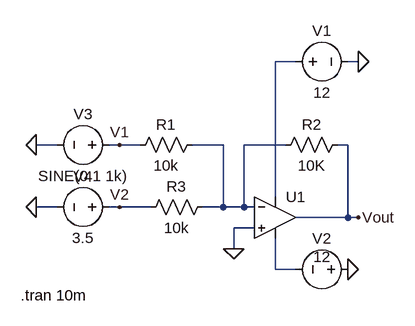
[diagram p0: schematic adder.asc]
adder.asc, the LTspice schematic file:
Version 4
SHEET 1 880 680
WIRE 240 -80 208 -80
WIRE 336 -80 320 -80
WIRE -128 48 -160 48
WIRE -32 48 -48 48
WIRE 0 48 -32 48
WIRE 128 48 80 48
WIRE 224 48 160 48
WIRE 320 48 304 48
WIRE 208 128 208 -80
WIRE -128 144 -160 144
WIRE -32 144 -48 144
WIRE 16 144 -32 144
WIRE 128 144 128 48
WIRE 128 144 96 144
WIRE 160 144 160 48
WIRE 160 144 128 144
WIRE 176 144 160 144
WIRE 320 160 320 48
WIRE 320 160 240 160
WIRE 336 160 320 160
WIRE 176 176 144 176
WIRE 144 208 144 176
WIRE 208 240 208 192
WIRE 240 240 208 240
FLAG 320 240 0
FLAG 144 208 0
FLAG 336 -80 0
FLAG 336 160 Vout
FLAG -160 48 0
FLAG -160 144 0
FLAG -32 48 V1
FLAG -32 144 V2
SYMBOL voltage 336 240 R90
WINDOW 0 -32 56 VBottom 2
WINDOW 3 -4 56 VBottom 2
WINDOW 123 0 0 Left 0
WINDOW 39 0 0 Left 0
SYMATTR InstName V2
SYMATTR Value 12
SYMBOL OpAmps\\UniversalOpamp 208 160 R0
SYMATTR InstName U1
SYMBOL res 320 32 R90
WINDOW 0 0 56 VBottom 2
WINDOW 3 32 56 VTop 2
SYMATTR InstName R2
SYMATTR Value 10K
SYMBOL voltage 224 -80 R270
WINDOW 0 32 56 VTop 2
WINDOW 3 -32 56 VBottom 2
WINDOW 123 0 0 Left 0
WINDOW 39 0 0 Left 0
SYMATTR InstName V1
SYMATTR Value 12
SYMBOL res 112 128 R90
WINDOW 0 0 56 VBottom 2
WINDOW 3 32 56 VTop 2
SYMATTR InstName R3
SYMATTR Value 10k
SYMBOL res 96 32 R90
WINDOW 0 0 56 VBottom 2
WINDOW 3 32 56 VTop 2
SYMATTR InstName R1
SYMATTR Value 10k
SYMBOL voltage -32 48 R90
WINDOW 0 -32 56 VBottom 2
WINDOW 3 32 56 VTop 2
WINDOW 123 0 0 Left 0
WINDOW 39 0 0 Left 0
SYMATTR InstName V3
SYMATTR Value SINE(0 1 1k)
SYMBOL voltage -32 144 R90
WINDOW 0 -32 56 VBottom 2
WINDOW 3 32 56 VTop 2
WINDOW 123 0 0 Left 0
WINDOW 39 0 0 Left 0
SYMATTR InstName V4
SYMATTR Value 3.5
TEXT -184 280 Left 2 !.tran 10m

The netlist it stands for:
* adder.asc
V2 0 N003 12
XU1 0 N002 N001 N003 Vout level1 Avol=1Meg GBW=10Meg Vos=0 En=0 Enk=0 In=0 Ink=0 Rin=500Meg  ; pins In+ In- V+ V- OUT
R2 Vout N002 10K
V1 N001 0 12
R3 N002 V2 10k
R1 N002 V1 10k
V3 V1 0 SINE(0 1 1k)
V4 V2 0 3.5
.tran 10m
.lib UniversalOpAmp1.lib
.backanno
.end